# EAGLE design scarf (EAGLE 6.5.0)
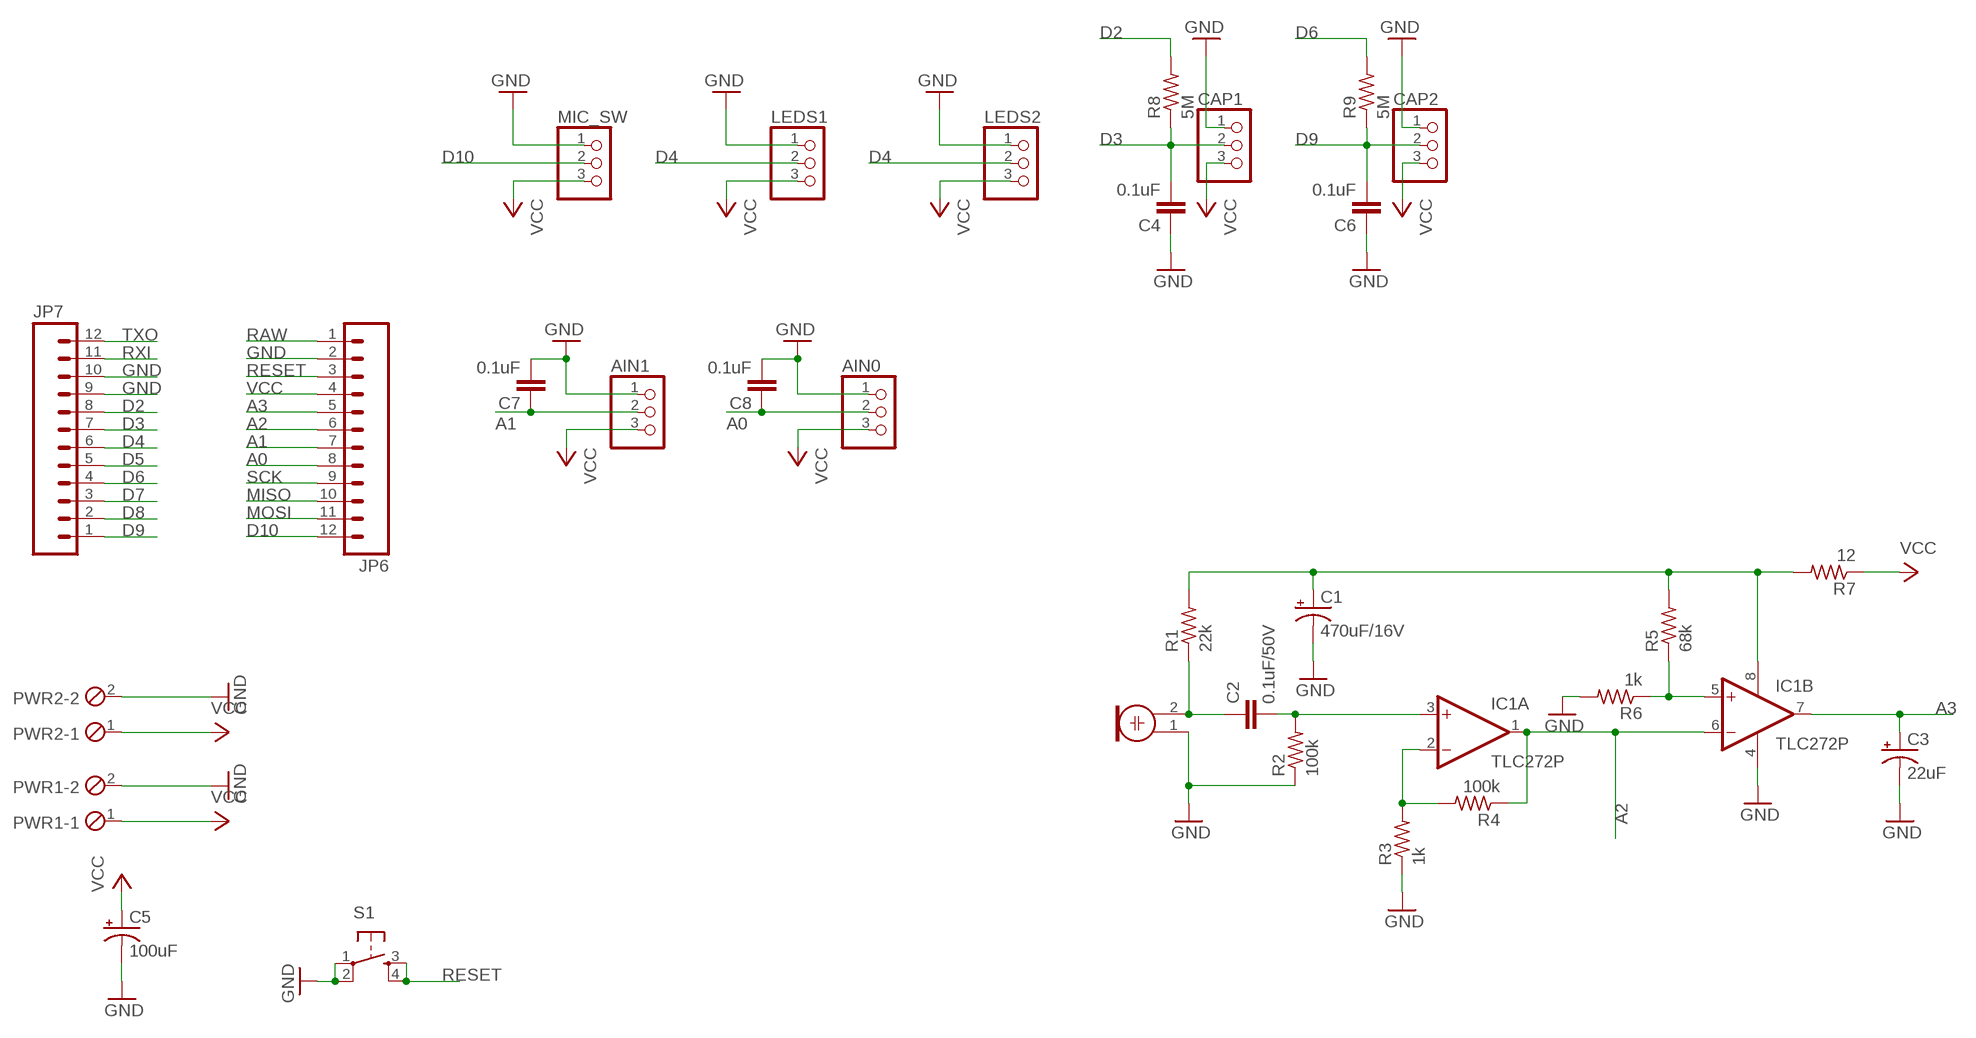
[diagram p0: schematic, sheet 1]

## Parts
AIN0  HEADER-1X3ROUND  [1X03_ROUND]
AIN1  HEADER-1X3ROUND  [1X03_ROUND]
C1  470uF/16V  CPOL-USE2.5-6  [E2,5-6]
C2  0.1uF/50V  C-EU050-025X075  [C050-025X075]
C3  22uF  CPOL-USE2.5-6  [E2,5-6]
C4  0.1uF  C-EU025-025X050  [C025-025X050]
C5  100uF  CPOL-USE3.5-8  [E3,5-8]
C6  0.1uF  C-EU025-025X050  [C025-025X050]
C7  0.1uF  C-EU025-025X050  [C025-025X050]
C8  0.1uF  C-EU025-025X050  [C025-025X050]
CAP1  HEADER-1X3ROUND  [1X03_ROUND]
CAP2  HEADER-1X3ROUND  [1X03_ROUND]
IC1  TLC272P  [DIL08]
JP6  M12PTH  [1X12]
JP7  M12PTH  [1X12]
LEDS1  PINHD-1X3  [1X03]
LEDS2  PINHD-1X3  [1X03]
M1  ELECTRET_MICROPHON-WM.64PN  [WM-64PN]
MIC_SW  HEADER-1X3ROUND  [1X03_ROUND]
PWR1  MPT2  [2POL254]
PWR2  MPT2  [2POL254]
R1  22k  R-US_0204/7  [0204/7]
R2  100k  R-US_0204/7  [0204/7]
R3  1k  R-US_0204/7  [0204/7]
R4  100k  R-US_0204/7  [0204/7]
R5  68k  R-US_0204/7  [0204/7]
R6  1k  R-US_0204/7  [0204/7]
R7  12  R-US_0204/7  [0204/7]
R8  5M  R-US_0204/7  [0204/7]
R9  5M  R-US_0204/7  [0204/7]
S1  TAC_SWITCHPTH  [TACTILE-PTH]

## Nets
A0: AIN0.2 C8.1 JP6.8
A1: AIN1.2 C7.1 JP6.7
A2: IC1.1(A:OUT) IC1.6(B:-IN) JP6.6 R4.1
A3: C3.+ IC1.7(B:OUT) JP6.5
D2: JP7.8 R8.2
D3: C4.2 CAP1.2 JP7.7 R8.1
D4: JP7.6 LEDS1.2 LEDS2.2
D5: JP7.5
D6: JP7.4 R9.2
D7: JP7.3
D8: JP7.2
D9: C6.2 CAP2.2 JP7.1 R9.1
D10: JP6.12 MIC_SW.2
GND [vcc]: AIN0.1 AIN1.1 C1.- C3.- C4.1 C5.- C6.1 C7.2 C8.2 CAP1.1 CAP2.1 IC1.4(P:V-) JP6.2 JP7.9 JP7.10 LEDS1.1 LEDS2.1 M1.1 MIC_SW.1 PWR1.2 PWR2.2 R2.1 R3.1 R6.2 S1.1 S1.2
MISO: JP6.10
MOSI: JP6.11
N$1: C2.2 IC1.3(A:+IN) R2.2
N$2: C2.1 M1.2 R1.1
N$3: IC1.2(A:-IN) R3.2 R4.2
N$5: IC1.5(B:+IN) R5.1 R6.1
N$6: C1.+ IC1.8(P:V+) R1.2 R5.2 R7.2
RAW [vcc]: JP6.1
RESET: JP6.3 S1.3 S1.4
RXI: JP7.11
SCK: JP6.9
TXO: JP7.12
VCC: AIN0.3 AIN1.3 C5.+ CAP1.3 CAP2.3 JP6.4 LEDS1.3 LEDS2.3 MIC_SW.3 PWR1.1 PWR2.1 R7.1

## Library data of the parts
AIN0 AIN1 CAP1 CAP2 MIC_SW = microbuilder:HEADER-1X3: PIN HEADER
C1 C3 C5 = rcl:CPOL-US: POLARIZED CAPACITOR, American symbol
C2 C4 C6-C8 = rcl:C-EU: CAPACITOR, European symbol
IC1 = linear:TLC272: OP AMP
JP6 JP7 = SparkFun:M12: Header 12 Standard 12-pin 0.1" header. Use with straight break away headers (SKU : PRT-00116), right angle break away headers (PRT-00553), swiss pins (PRT-00743), machine pins (PRT-00117), and female headers (PRT-00115).
LEDS1 LEDS2 = pinhead:PINHD-1X3: PIN HEADER
M1 = microphon:ELECTRET_MICROPHON-: Electret Condenser Microphone
PWR1 PWR2 = con-phoenix-254:MPT2: PHOENIX CONNECTOR; OC_FARNELL: unknown; OC_NEWARK: unknown
R1-R9 = rcl:R-US_: RESISTOR, American symbol
S1 = SparkFun-Electromechanical:TAC_SWITCH: Momentary Switch Button commonly used for reset or general input. Spark Fun Electronics SKU : COM-00097 SMT- SWCH-08247

## Net classes
0 default: width 0.254 mm
1 vcc: width 0.406 mm

## Board
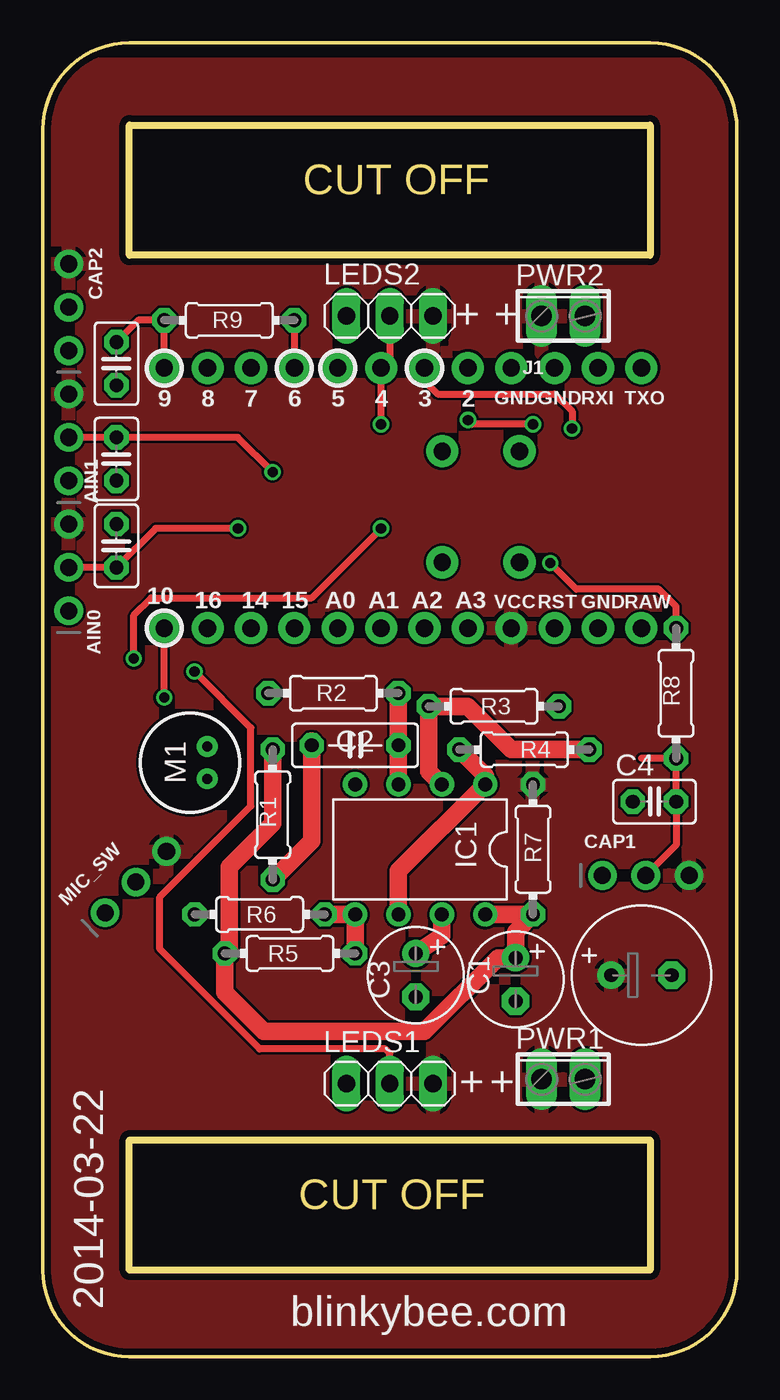
[diagram p1: board, top side]
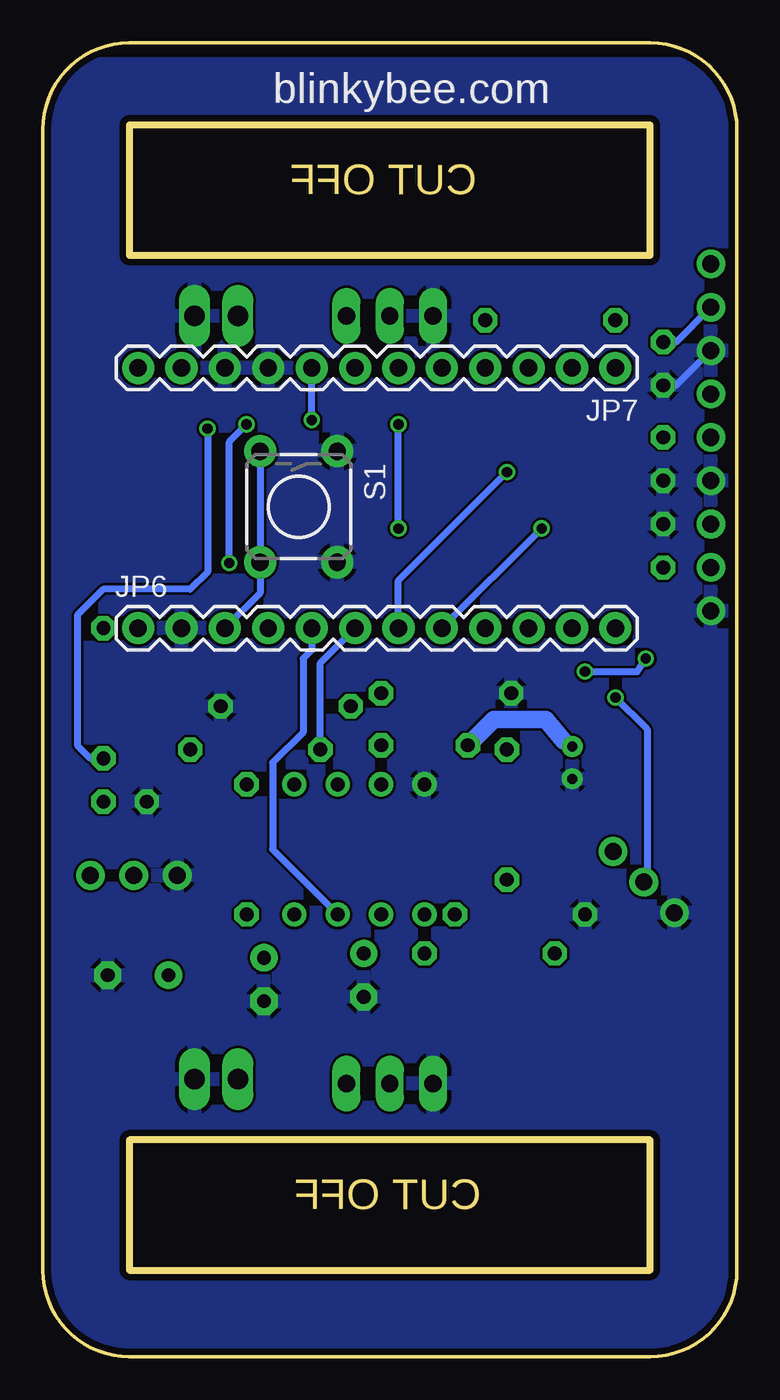
[diagram p2: board, bottom side, seen from below]

Size 40.64 x 76.96 mm. Coordinates in mm from the lower left corner, seen from the top.
Outline: 40.64,71.88 40.64,5.08 arc-90 35.56,0 5.08,0 arc-90 0,5.08 0,71.88 arc-90 5.08,76.96 35.56,76.96 arc-90 40.64,71.88
Outline: 5.08,72.14 35.56,72.14 35.56,64.52 5.08,64.52 5.08,72.14
Outline: 5.08,12.7 35.56,12.7 35.56,5.08 5.08,5.08 5.08,12.7
Copper layers (1*16): Top 0.0356mm / dielectric 1.5011mm / Bottom 0.0356mm
Design rules "oshpark_2layer *": minimum track width 6mil, minimum drill 13mil, track to track 6mil, track to pad 6mil, pad to pad 6mil, via to via 6mil, smd to smd 6mil, copper to edge 15mil, drill to drill 6mil, minimum pad ring 12mil, minimum via ring 7mil, stop-mask expansion 3mil, vias tented up to drill 20mil, thermal gap 10mil

### Footprints (pad centres in the part's own frame; a part is rotated, then mirrored left to right if it is on the bottom)
1X03_ROUND = drill 1 pad 1.676: 1 -2.54,0; 2 0,0; 3 2.54,0
E2,5-6 = drill 0.813 pad 1.6: + -1.27,0 | drill 0.813 pad 1.6 octagon: - 1.27,0
C050-025X075 = drill 0.813 octagon: 1 -2.54,0; 2 2.54,0
C025-025X050 = drill 0.813 octagon: 1 -1.27,0; 2 1.27,0
E3,5-8 = drill 0.813 pad 1.6: + -1.778,0 | drill 0.813 pad 1.6 octagon: - 1.778,0
DIL08 = drill 0.813 pad 1.27: 1 -3.81,-3.81; 2 -1.27,-3.81; 3 1.27,-3.81; 4 3.81,-3.81; 5 3.81,3.81; 6 1.27,3.81; 7 -1.27,3.81; 8 -3.81,3.81
1X12 = drill 1.016 pad 1.88: 1 0,0; 2 2.54,0; 3 5.08,0; 4 7.62,0; 5 10.16,0; 6 12.7,0; 7 15.24,0; 8 17.78,0; 9 20.32,0; 10 22.86,0; 11 25.4,0; 12 27.94,0
1X03 = drill 1.016 long: 1 -2.54,0; 2 0,0; 3 2.54,0
WM-64PN = drill 0.6 pad 1: 1 -1,0.95; 2 -1,-0.95
2POL254 = drill 1.2 long: 1 -1.27,0; 2 1.27,0
0204/7 = drill 0.813 octagon: 1 -3.81,0; 2 3.81,0
TACTILE-PTH = drill 1.016 pad 1.88: 1 -3.251,2.261; 2 3.251,2.261; 3 -3.251,-2.261; 4 3.251,-2.261

### Placement (x,y rotation side)
AIN0  1.52,46.23 90 top
AIN1  1.52,53.85 90 top
C1  27.69,22.1 270 top
C2  18.29,35.81 0 top
C3  21.84,22.35 270 top
C4  35.81,32.51 0 top
C5  35.05,22.35 0 top
C6  4.32,58.17 90 top
C7  4.32,52.58 270 top
C8  4.32,47.5 90 top
CAP1  35.31,28.19 0 top
CAP2  1.52,61.47 90 top
IC1  22.1,29.72 180 top
JP6  35.05,42.67 0 bottom
JP7  7.11,57.91 180 bottom
LEDS1  20.32,16 0 top
LEDS2  20.32,60.96 0 top
M1  8.64,34.8 180 top
MIC_SW  5.45,27.8 45 top
PWR1  30.48,16.26 0 top
PWR2  30.48,60.96 0 top
R1  13.46,31.75 90 top
R2  17.02,38.86 0 top
R3  26.42,38.1 180 top
R4  28.19,35.56 0 top
R5  14.48,23.62 180 top
R6  12.7,25.91 180 top
R7  28.7,29.72 270 top
R8  37.08,38.86 90 top
R9  10.92,60.71 0 top
S1  25.65,49.78 270 bottom

### Tracks (layer width: path | path; a pad name or v marks a point on that pad's centre or on a via)
A0  (via drill 0.6)
  Top 0.406: AIN0.2 C8.1 6.6,48.51 v11.43,48.51
  Bottom 0.406: v11.43,48.51 JP6.8
A1  (via drill 0.6)
  Top 0.406: AIN1.2 C7.1 11.43,53.85 v13.46,51.82
  Bottom 0.406: JP6.7 19.81,45.47 v13.46,51.82
A2
  Top 1.016: IC1.6 20.83,28.45 IC1.1 25.91,34.04 R4.1
  Bottom 0.406: R4.1 24.38,40.64 JP6.6
A3
  Top 1.016: IC1.7 23.37,24.64 C3.+
  Bottom 0.406: JP6.5 24.89,41.4 25.4,40.89 25.4,36.58 27.18,34.8 27.18,29.72 IC1.7
D2  (via drill 0.6)
  Top 0.406: R8.2 37.08,43.94 36.07,44.96 31.24,44.96 v29.72,46.48 | v28.7,54.61 25.15,54.61 v24.89,54.86
  Bottom 0.406: v29.72,46.48 29.72,53.59 v28.7,54.61 | v24.89,54.86 JP7.8
D3  (via drill 0.6)
  Top 0.406: 35.05,35.05 R8.1 C4.2 37.08,29.97 CAP1.2 | v30.99,54.36 30.99,55.37 29.97,56.39 23.11,56.39 22.35,57.15 JP7.7
  Bottom 0.406: v30.99,54.36 30.99,45.97 32,44.96 37.08,44.96 38.61,43.43 38.61,35.81 37.85,35.05 R8.1
D4  (via drill 0.6)
  Top 0.406: LEDS2.2 20.32,58.42 JP7.6 v19.81,54.61 | LEDS1.2 20.32,17.78 20.07,18.03 12.7,18.03 6.86,23.88 6.86,26.92 12.19,32.26 12.19,36.83 v8.89,40.13 | v5.33,40.89 5.33,43.43 6.35,44.45 15.75,44.45 v19.81,48.51
  Bottom 0.406: v19.81,48.51 v19.81,54.61 | v8.89,40.13 5.84,40.13 v5.33,40.89
D6
  Top 0.406: R9.2 JP7.4
D9
  Top 0.406: JP7.1 R9.1 5.59,60.71 C6.2
  Bottom 0.406: C6.2 3.56,59.44 CAP2.2
D10  (via drill 0.6)
  Top 0.406: v7.11,38.61 JP6.12
  Bottom 0.406: v7.11,38.61 5.26,36.76 5.26,28 MIC_SW.2
GND
  Bottom 0.406: C6.1 3.56,56.9 CAP2.1
  pour Bottom: 40.39,75.69 40.39,0.25 0.25,0.25 0.25,75.69
N$1
  Top 1.016: R2.2 C2.2 IC1.3
N$2
  Top 1.016: R1.1 15.75,30.23 C2.1 15.75,36.07
  Bottom 1.016: M1.2 10.14,36.05 11.18,37.34 14.22,37.34 C2.1
N$3
  Top 1.016: IC1.2 22.61,34.29 R3.2 24.89,38.1 27.43,35.56 R4.2
N$5
  Top 1.016: R5.1 IC1.5 R6.1
N$6
  Top 1.016: IC1.8 R7.2 27.69,24.89 C1.+ 26.67,23.37 22.35,19.05 12.95,19.05 10.67,21.34 R5.2 10.92,23.88 10.92,28.7 13.46,31.24 R1.2
RESET
  Bottom 0.406: S1.3 S1.4 27.91,44.73 JP6.3
VCC
  pour Top: 40.39,75.69 40.39,0.25 0.25,0.25 0.25,75.69

### Text on the board
Dimension: CUT OFF | CUT OFF
tPlace: J1 | 9 | 8 | 7 | 6 | 5 | 4 | 3 | 2 | GND | GND | RXI | TXO | 14 | 10 | 16 | 15 | A0 | A1 | A2 | A3 | VCC | RST | GND | RAW
tNames: + | + | + | + | blinkybee.com | 2014-03-22
bNames: blinkybee.com